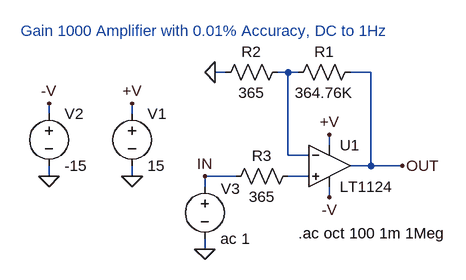
[diagram p0: schematic 1124.asc]
1124.asc, the LTspice schematic file:
Version 4
SHEET 1 896 680
WIRE -64 96 -80 96
WIRE 32 96 16 96
WIRE 48 96 32 96
WIRE 160 96 128 96
WIRE -336 160 -336 144
WIRE -208 160 -208 144
WIRE 96 208 96 192
WIRE 32 224 32 96
WIRE 64 224 32 224
WIRE 160 240 160 96
WIRE 160 240 128 240
WIRE 208 240 160 240
WIRE -336 256 -336 240
WIRE -208 256 -208 240
WIRE -48 256 -96 256
WIRE 64 256 32 256
WIRE -96 272 -96 256
WIRE 96 288 96 272
WIRE -96 368 -96 352
FLAG -208 256 0
FLAG 96 192 +V
FLAG -208 144 +V
FLAG 96 288 -V
FLAG -336 256 0
FLAG -336 144 -V
FLAG -80 96 0
FLAG -96 368 0
FLAG 208 240 OUT
FLAG -96 256 IN
SYMBOL voltage -208 144 R0
SYMATTR InstName V1
SYMATTR Value 15
SYMBOL voltage -336 144 R0
SYMATTR InstName V2
SYMATTR Value -15
SYMBOL res 144 80 R90
WINDOW 0 0 56 VBottom 2
WINDOW 3 32 56 VTop 2
SYMATTR InstName R1
SYMATTR Value 364.76K
SYMBOL res 32 80 R90
WINDOW 0 0 56 VBottom 2
WINDOW 3 32 56 VTop 2
SYMATTR InstName R2
SYMATTR Value 365
SYMBOL voltage -96 256 R0
WINDOW 0 25 19 Left 2
SYMATTR InstName V3
SYMATTR Value ac 1
SYMBOL opamps\\LT1124 96 176 R0
SYMATTR InstName U1
SYMBOL res 48 240 R90
WINDOW 0 0 56 VBottom 2
WINDOW 3 32 56 VTop 2
SYMATTR InstName R3
SYMATTR Value 365
TEXT 48 344 Left 2 !.ac oct 100 1m 1Meg
TEXT -96 48 Bottom 2 ;Gain 1000 Amplifier with 0.01% Accuracy, DC to 1Hz

The netlist it stands for:
* 1124.asc
V1 +V 0 15
V2 -V 0 -15
R1 OUT N001 364.76K
R2 N001 0 365
V3 IN 0 ac 1
XU1 N002 N001 +V -V OUT LT1124  ; pins In+ In- V+ V- OUT
R3 N002 IN 365
.ac oct 100 1m 1Meg
* Gain 1000 Amplifier with 0.01% Accuracy, DC to 1Hz
.lib LTC.lib
.backanno
.end